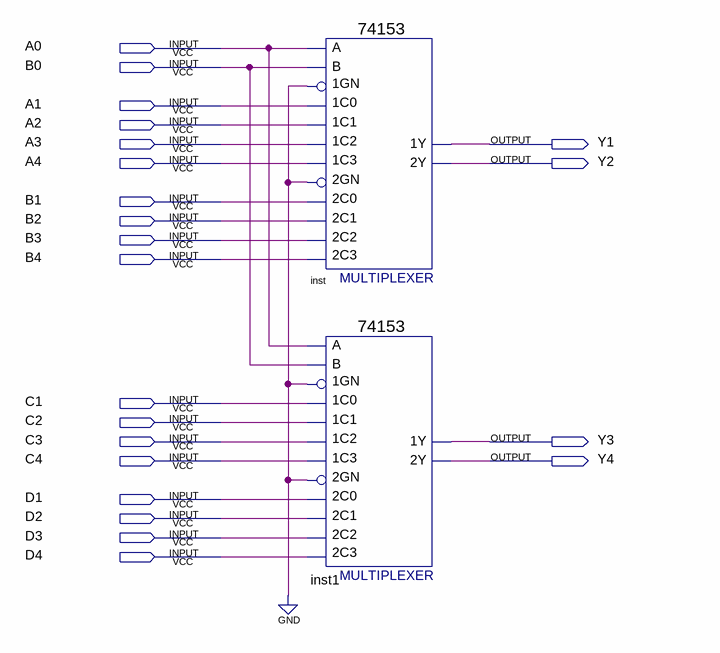
[diagram p0: schematic sheet]
// Quartus schematic CPLD_4bit_4to1_Mux.bdf as structural Verilog: 2 symbols, 22 pins
module CPLD_4bit_4to1_Mux (
  input  A0,
  input  B0,
  input  A1,
  input  A2,
  input  A3,
  input  A4,
  input  B1,
  input  B2,
  input  B3,
  input  B4,
  input  C1,
  input  C2,
  input  C3,
  input  C4,
  input  D1,
  input  D2,
  input  D3,
  input  D4,
  output Y1,
  output Y2,
  output Y3,
  output Y4
);

  \74153  inst (
    .\1C1 (A2), .\1GN (1'b0), .\1C0 (A1), .\2C0 (B1), .\2GN (1'b0), .\2C2 (B3), .\1C2 (A3), .\1C3 (A4),
    .B(B0), .A(A0), .\2C1 (B2), .\2C3 (B4), .\1Y (Y1), .\2Y (Y2));
  \74153  inst1 (
    .\1C1 (C2), .\1GN (1'b0), .\1C0 (C1), .\2C0 (D1), .\2GN (1'b0), .\2C2 (D3), .\1C2 (C3), .\1C3 (C4),
    .B(B0), .A(A0), .\2C1 (D2), .\2C3 (D4), .\1Y (Y3), .\2Y (Y4));
endmodule
